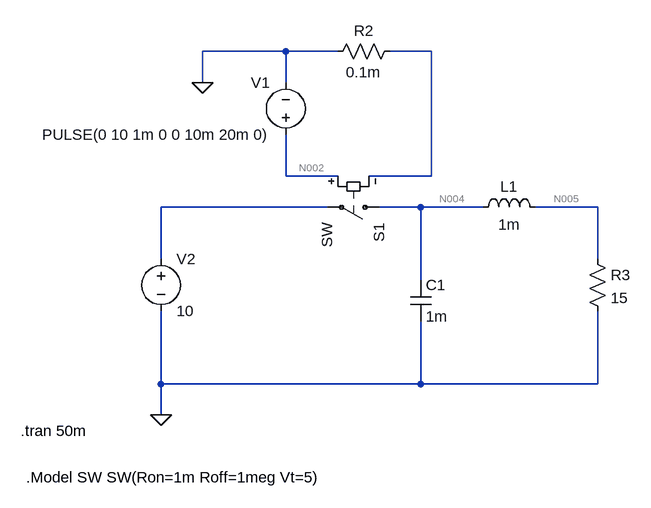
[diagram p0: schematic condensor_v2.asc]
condensor_v2.asc, the LTspice schematic file:
Version 4.1
SHEET 1 880 680
WIRE 304 -176 176 -176
WIRE 384 -176 304 -176
WIRE 528 -176 464 -176
WIRE 176 -128 176 -176
WIRE 304 -128 304 -176
WIRE 304 16 304 -48
WIRE 384 16 304 16
WIRE 528 16 528 -176
WIRE 528 16 432 16
WIRE 368 64 112 64
WIRE 512 64 448 64
WIRE 608 64 512 64
WIRE 784 64 688 64
WIRE 112 144 112 64
WIRE 784 144 784 64
WIRE 512 176 512 64
WIRE 112 336 112 224
WIRE 512 336 512 240
WIRE 512 336 112 336
WIRE 784 336 784 224
WIRE 784 336 512 336
WIRE 112 384 112 336
FLAG 176 -128 0
FLAG 112 384 0
SYMBOL sw 464 64 R90
SYMATTR InstName S1
SYMBOL voltage 304 -32 R180
WINDOW 0 24 96 Left 2
WINDOW 3 24 16 Left 2
WINDOW 123 0 0 Left 0
WINDOW 39 0 0 Left 0
SYMATTR InstName V1
SYMATTR Value PULSE(0 10 1m 0 0 10m 20m 0)
SYMBOL res 480 -192 R90
WINDOW 0 0 56 VBottom 2
WINDOW 3 32 56 VTop 2
SYMATTR InstName R2
SYMATTR Value 0.1m
SYMBOL res 768 128 R0
SYMATTR InstName R3
SYMATTR Value 15
SYMBOL voltage 112 128 R0
WINDOW 123 0 0 Left 0
WINDOW 39 0 0 Left 0
SYMATTR InstName V2
SYMATTR Value 10
SYMBOL cap 496 176 R0
SYMATTR InstName C1
SYMATTR Value 1m
SYMBOL ind 592 80 R270
WINDOW 0 32 56 VTop 2
WINDOW 3 5 56 VBottom 2
SYMATTR InstName L1
SYMATTR Value 1m
TEXT -104 408 Left 2 !.tran 50m
TEXT -96 480 Left 2 !.Model SW SW(Ron=1m Roff=1meg Vt=5)

The netlist it stands for:
* condensor_v2.asc
S1 N004 N003 N002 N001 SW
V1 N002 0 PULSE(0 10 1m 0 0 10m 20m 0)
R2 N001 0 0.1m
R3 N005 0 15
V2 N003 0 10
C1 N004 0 1m
L1 N004 N005 1m
.tran 50m
.Model SW SW(Ron=1m Roff=1meg Vt=5)
.backanno
.end

* Results of the author's LTspice run, read from the files saved beside the schematic
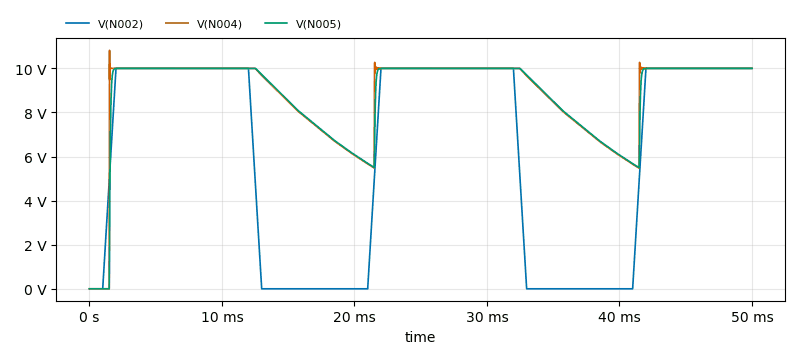
[diagram p1: Transient Analysis of condensor_v2.asc, plotted from the saved traces]
* Transient Analysis, 1 run:
*   V(N002): min 0 V, max 10 V, average 6.1 V, rms 7.718 V, last 10 V
*   V(N004): min 150 µV, max 10.82 V, average 8.808 V, rms 9.059 V, last 9.999 V
*   V(N005): min 150 µV, max 9.999 V, average 8.794 V, rms 9.046 V, last 9.999 V